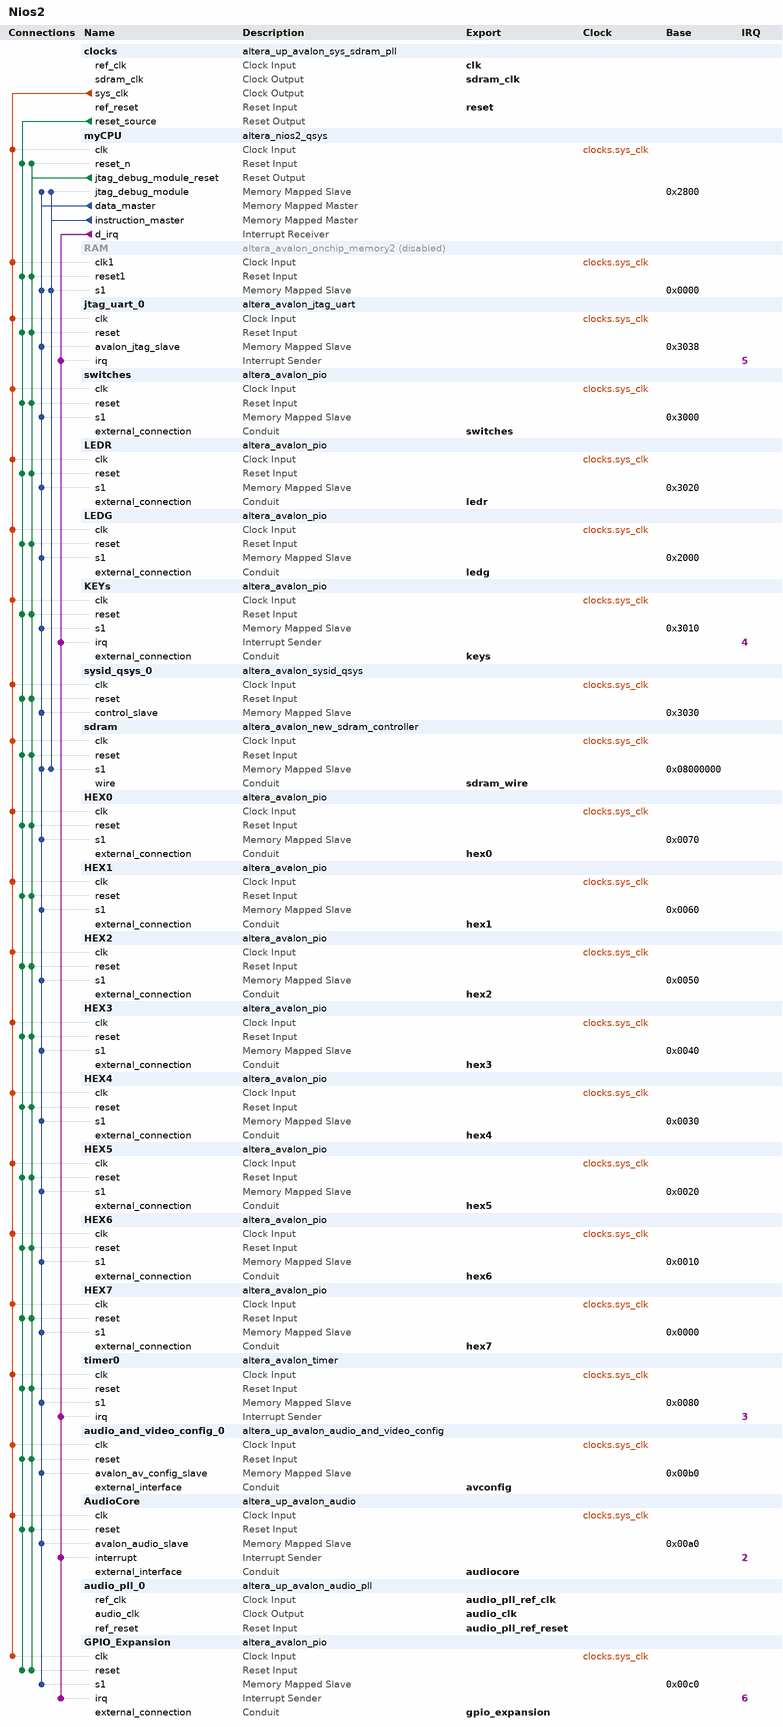
[diagram p0: system contents]
# Platform Designer (Qsys) system Nios2, Cyclone IV E EP4CE115F29C7
# Parameters at their usual value, and those the tool derives, are not listed.
package require -exact qsys 16.1
create_system Nios2
set_project_property DEVICE_FAMILY {Cyclone IV E}
set_project_property DEVICE EP4CE115F29C7

add_instance clocks altera_up_avalon_sys_sdram_pll 16.1
set_instance_parameter_value clocks CV_boards DE1-SoC
set_instance_parameter_value clocks gui_outclk 50.0
set_instance_parameter_value clocks gui_refclk 50.0

add_instance myCPU altera_nios2_qsys 16.1
set_instance_parameter_value myCPU breakSlave myCPU.jtag_debug_module
set_instance_parameter_value myCPU exceptionSlave sdram.s1
set_instance_parameter_value myCPU icache_size 4096
set_instance_parameter_value myCPU impl Fast
set_instance_parameter_value myCPU mmu_TLBMissExcSlave None
set_instance_parameter_value myCPU resetSlave sdram.s1
set_instance_parameter_value myCPU resetrequest_enabled true

add_instance RAM altera_avalon_onchip_memory2 16.1
set_instance_property RAM ENABLED false
set_instance_parameter_value RAM dataWidth 32
set_instance_parameter_value RAM dualPort false
set_instance_parameter_value RAM initMemContent true
set_instance_parameter_value RAM initializationFileName onchip_mem.hex
set_instance_parameter_value RAM memorySize 8192

add_instance jtag_uart_0 altera_avalon_jtag_uart 16.1
set_instance_parameter_value jtag_uart_0 simInteractiveOptions NO_INTERACTIVE_WINDOWS

add_instance switches altera_avalon_pio 16.1
set_instance_parameter_value switches captureEdge true
set_instance_parameter_value switches direction Input
set_instance_parameter_value switches width 18

add_instance LEDR altera_avalon_pio 16.1
set_instance_parameter_value LEDR direction Output
set_instance_parameter_value LEDR width 18

add_instance LEDG altera_avalon_pio 16.1
set_instance_parameter_value LEDG direction Output
set_instance_parameter_value LEDG width 8

add_instance KEYs altera_avalon_pio 16.1
set_instance_parameter_value KEYs captureEdge true
set_instance_parameter_value KEYs direction Input
set_instance_parameter_value KEYs edgeType FALLING
set_instance_parameter_value KEYs generateIRQ true
set_instance_parameter_value KEYs irqType EDGE
set_instance_parameter_value KEYs width 4

add_instance sysid_qsys_0 altera_avalon_sysid_qsys 16.1
set_instance_parameter_value sysid_qsys_0 id 0

add_instance sdram altera_avalon_new_sdram_controller 16.1
set_instance_parameter_value sdram TAC 5.4
set_instance_parameter_value sdram TRCD 15.0
set_instance_parameter_value sdram TRP 15.0
set_instance_parameter_value sdram casLatency 3
set_instance_parameter_value sdram columnWidth 10
set_instance_parameter_value sdram dataWidth 32
set_instance_parameter_value sdram generateSimulationModel false
set_instance_parameter_value sdram model single_Micron_MT48LC4M32B2_7_chip
set_instance_parameter_value sdram numberOfBanks 4
set_instance_parameter_value sdram numberOfChipSelects 1
set_instance_parameter_value sdram powerUpDelay 100.0
set_instance_parameter_value sdram refreshPeriod 7.8125
set_instance_parameter_value sdram rowWidth 13

add_instance HEX0 altera_avalon_pio 16.1
set_instance_parameter_value HEX0 direction Output
set_instance_parameter_value HEX0 width 7

add_instance HEX1 altera_avalon_pio 16.1
set_instance_parameter_value HEX1 direction Output
set_instance_parameter_value HEX1 width 7

add_instance HEX2 altera_avalon_pio 16.1
set_instance_parameter_value HEX2 direction Output
set_instance_parameter_value HEX2 width 7

add_instance HEX3 altera_avalon_pio 16.1
set_instance_parameter_value HEX3 direction Output
set_instance_parameter_value HEX3 width 7

add_instance HEX4 altera_avalon_pio 16.1
set_instance_parameter_value HEX4 direction Output
set_instance_parameter_value HEX4 width 7

add_instance HEX5 altera_avalon_pio 16.1
set_instance_parameter_value HEX5 direction Output
set_instance_parameter_value HEX5 width 7

add_instance HEX6 altera_avalon_pio 16.1
set_instance_parameter_value HEX6 direction Output
set_instance_parameter_value HEX6 width 7

add_instance HEX7 altera_avalon_pio 16.1
set_instance_parameter_value HEX7 direction Output
set_instance_parameter_value HEX7 width 7

add_instance timer0 altera_avalon_timer 16.1
set_instance_parameter_value timer0 period 1
set_instance_parameter_value timer0 periodUnits MSEC

add_instance audio_and_video_config_0 altera_up_avalon_audio_and_video_config 16.1
set_instance_parameter_value audio_and_video_config_0 audio_in {Line In to ADC}
set_instance_parameter_value audio_and_video_config_0 bit_length 32
set_instance_parameter_value audio_and_video_config_0 board DE2-115
set_instance_parameter_value audio_and_video_config_0 line_in_bypass false
set_instance_parameter_value audio_and_video_config_0 sampling_rate {48 kHz}

add_instance AudioCore altera_up_avalon_audio 16.1
set_instance_parameter_value AudioCore audio_in true
set_instance_parameter_value AudioCore avalon_bus_type {Memory Mapped}
set_instance_parameter_value AudioCore dw 32

add_instance audio_pll_0 altera_up_avalon_audio_pll 16.1
set_instance_parameter_value audio_pll_0 gui_refclk 50.0

add_instance GPIO_Expansion altera_avalon_pio 16.1
set_instance_parameter_value GPIO_Expansion captureEdge true
set_instance_parameter_value GPIO_Expansion direction Bidir
set_instance_parameter_value GPIO_Expansion edgeType ANY
set_instance_parameter_value GPIO_Expansion generateIRQ true
set_instance_parameter_value GPIO_Expansion irqType EDGE
set_instance_parameter_value GPIO_Expansion width 32

# connections
add_connection clocks.sys_clk audio_and_video_config_0.clk clock
add_connection clocks.sys_clk AudioCore.clk clock
add_connection clocks.sys_clk GPIO_Expansion.clk clock
add_connection clocks.sys_clk HEX0.clk clock
add_connection clocks.sys_clk HEX1.clk clock
add_connection clocks.sys_clk HEX2.clk clock
add_connection clocks.sys_clk HEX3.clk clock
add_connection clocks.sys_clk HEX4.clk clock
add_connection clocks.sys_clk HEX5.clk clock
add_connection clocks.sys_clk HEX6.clk clock
add_connection clocks.sys_clk HEX7.clk clock
add_connection clocks.sys_clk jtag_uart_0.clk clock
add_connection clocks.sys_clk KEYs.clk clock
add_connection clocks.sys_clk LEDG.clk clock
add_connection clocks.sys_clk LEDR.clk clock
add_connection clocks.sys_clk myCPU.clk clock
add_connection clocks.sys_clk RAM.clk1 clock
add_connection clocks.sys_clk sdram.clk clock
add_connection clocks.sys_clk switches.clk clock
add_connection clocks.sys_clk sysid_qsys_0.clk clock
add_connection clocks.sys_clk timer0.clk clock
add_connection clocks.reset_source audio_and_video_config_0.reset reset
add_connection clocks.reset_source AudioCore.reset reset
add_connection clocks.reset_source GPIO_Expansion.reset reset
add_connection clocks.reset_source HEX0.reset reset
add_connection clocks.reset_source HEX1.reset reset
add_connection clocks.reset_source HEX2.reset reset
add_connection clocks.reset_source HEX3.reset reset
add_connection clocks.reset_source HEX4.reset reset
add_connection clocks.reset_source HEX5.reset reset
add_connection clocks.reset_source HEX6.reset reset
add_connection clocks.reset_source HEX7.reset reset
add_connection clocks.reset_source jtag_uart_0.reset reset
add_connection clocks.reset_source KEYs.reset reset
add_connection clocks.reset_source LEDG.reset reset
add_connection clocks.reset_source LEDR.reset reset
add_connection clocks.reset_source myCPU.reset_n reset
add_connection clocks.reset_source RAM.reset1 reset
add_connection clocks.reset_source sdram.reset reset
add_connection clocks.reset_source switches.reset reset
add_connection clocks.reset_source sysid_qsys_0.reset reset
add_connection clocks.reset_source timer0.reset reset
add_connection myCPU.jtag_debug_module_reset audio_and_video_config_0.reset reset
add_connection myCPU.jtag_debug_module_reset AudioCore.reset reset
add_connection myCPU.jtag_debug_module_reset GPIO_Expansion.reset reset
add_connection myCPU.jtag_debug_module_reset HEX0.reset reset
add_connection myCPU.jtag_debug_module_reset HEX1.reset reset
add_connection myCPU.jtag_debug_module_reset HEX2.reset reset
add_connection myCPU.jtag_debug_module_reset HEX3.reset reset
add_connection myCPU.jtag_debug_module_reset HEX4.reset reset
add_connection myCPU.jtag_debug_module_reset HEX5.reset reset
add_connection myCPU.jtag_debug_module_reset HEX6.reset reset
add_connection myCPU.jtag_debug_module_reset HEX7.reset reset
add_connection myCPU.jtag_debug_module_reset jtag_uart_0.reset reset
add_connection myCPU.jtag_debug_module_reset KEYs.reset reset
add_connection myCPU.jtag_debug_module_reset LEDG.reset reset
add_connection myCPU.jtag_debug_module_reset LEDR.reset reset
add_connection myCPU.jtag_debug_module_reset myCPU.reset_n reset
add_connection myCPU.jtag_debug_module_reset RAM.reset1 reset
add_connection myCPU.jtag_debug_module_reset sdram.reset reset
add_connection myCPU.jtag_debug_module_reset switches.reset reset
add_connection myCPU.jtag_debug_module_reset sysid_qsys_0.reset reset
add_connection myCPU.jtag_debug_module_reset timer0.reset reset
add_connection myCPU.data_master audio_and_video_config_0.avalon_av_config_slave avalon
set_connection_parameter_value myCPU.data_master/audio_and_video_config_0.avalon_av_config_slave baseAddress 0x00b0
add_connection myCPU.data_master AudioCore.avalon_audio_slave avalon
set_connection_parameter_value myCPU.data_master/AudioCore.avalon_audio_slave baseAddress 0x00a0
add_connection myCPU.data_master GPIO_Expansion.s1 avalon
set_connection_parameter_value myCPU.data_master/GPIO_Expansion.s1 baseAddress 0x00c0
add_connection myCPU.data_master HEX0.s1 avalon
set_connection_parameter_value myCPU.data_master/HEX0.s1 baseAddress 0x0070
add_connection myCPU.data_master HEX1.s1 avalon
set_connection_parameter_value myCPU.data_master/HEX1.s1 baseAddress 0x0060
add_connection myCPU.data_master HEX2.s1 avalon
set_connection_parameter_value myCPU.data_master/HEX2.s1 baseAddress 0x0050
add_connection myCPU.data_master HEX3.s1 avalon
set_connection_parameter_value myCPU.data_master/HEX3.s1 baseAddress 0x0040
add_connection myCPU.data_master HEX4.s1 avalon
set_connection_parameter_value myCPU.data_master/HEX4.s1 baseAddress 0x0030
add_connection myCPU.data_master HEX5.s1 avalon
set_connection_parameter_value myCPU.data_master/HEX5.s1 baseAddress 0x0020
add_connection myCPU.data_master HEX6.s1 avalon
set_connection_parameter_value myCPU.data_master/HEX6.s1 baseAddress 0x0010
add_connection myCPU.data_master HEX7.s1 avalon
set_connection_parameter_value myCPU.data_master/HEX7.s1 baseAddress 0x0000
add_connection myCPU.data_master jtag_uart_0.avalon_jtag_slave avalon
set_connection_parameter_value myCPU.data_master/jtag_uart_0.avalon_jtag_slave baseAddress 0x3038
add_connection myCPU.data_master KEYs.s1 avalon
set_connection_parameter_value myCPU.data_master/KEYs.s1 baseAddress 0x3010
add_connection myCPU.data_master LEDG.s1 avalon
set_connection_parameter_value myCPU.data_master/LEDG.s1 baseAddress 0x2000
add_connection myCPU.data_master LEDR.s1 avalon
set_connection_parameter_value myCPU.data_master/LEDR.s1 baseAddress 0x3020
add_connection myCPU.data_master myCPU.jtag_debug_module avalon
set_connection_parameter_value myCPU.data_master/myCPU.jtag_debug_module baseAddress 0x2800
add_connection myCPU.data_master RAM.s1 avalon
set_connection_parameter_value myCPU.data_master/RAM.s1 baseAddress 0x0000
add_connection myCPU.data_master sdram.s1 avalon
set_connection_parameter_value myCPU.data_master/sdram.s1 baseAddress 0x08000000
add_connection myCPU.data_master switches.s1 avalon
set_connection_parameter_value myCPU.data_master/switches.s1 baseAddress 0x3000
add_connection myCPU.data_master sysid_qsys_0.control_slave avalon
set_connection_parameter_value myCPU.data_master/sysid_qsys_0.control_slave baseAddress 0x3030
add_connection myCPU.data_master timer0.s1 avalon
set_connection_parameter_value myCPU.data_master/timer0.s1 baseAddress 0x0080
add_connection myCPU.instruction_master myCPU.jtag_debug_module avalon
set_connection_parameter_value myCPU.instruction_master/myCPU.jtag_debug_module baseAddress 0x2800
add_connection myCPU.instruction_master RAM.s1 avalon
set_connection_parameter_value myCPU.instruction_master/RAM.s1 baseAddress 0x0000
add_connection myCPU.instruction_master sdram.s1 avalon
set_connection_parameter_value myCPU.instruction_master/sdram.s1 baseAddress 0x08000000
add_connection myCPU.d_irq AudioCore.interrupt interrupt
set_connection_parameter_value myCPU.d_irq/AudioCore.interrupt irqNumber 2
add_connection myCPU.d_irq GPIO_Expansion.irq interrupt
set_connection_parameter_value myCPU.d_irq/GPIO_Expansion.irq irqNumber 6
add_connection myCPU.d_irq jtag_uart_0.irq interrupt
set_connection_parameter_value myCPU.d_irq/jtag_uart_0.irq irqNumber 5
add_connection myCPU.d_irq KEYs.irq interrupt
set_connection_parameter_value myCPU.d_irq/KEYs.irq irqNumber 4
add_connection myCPU.d_irq timer0.irq interrupt
set_connection_parameter_value myCPU.d_irq/timer0.irq irqNumber 3

# exported interfaces
add_interface audio_clk clock source
set_interface_property audio_clk EXPORT_OF audio_pll_0.audio_clk
add_interface audio_pll_ref_clk clock sink
set_interface_property audio_pll_ref_clk EXPORT_OF audio_pll_0.ref_clk
add_interface audio_pll_ref_reset reset sink
set_interface_property audio_pll_ref_reset EXPORT_OF audio_pll_0.ref_reset
add_interface audiocore conduit end
set_interface_property audiocore EXPORT_OF AudioCore.external_interface
add_interface avconfig conduit end
set_interface_property avconfig EXPORT_OF audio_and_video_config_0.external_interface
add_interface clk clock sink
set_interface_property clk EXPORT_OF clocks.ref_clk
add_interface gpio_expansion conduit end
set_interface_property gpio_expansion EXPORT_OF GPIO_Expansion.external_connection
add_interface hex0 conduit end
set_interface_property hex0 EXPORT_OF HEX0.external_connection
add_interface hex1 conduit end
set_interface_property hex1 EXPORT_OF HEX1.external_connection
add_interface hex2 conduit end
set_interface_property hex2 EXPORT_OF HEX2.external_connection
add_interface hex3 conduit end
set_interface_property hex3 EXPORT_OF HEX3.external_connection
add_interface hex4 conduit end
set_interface_property hex4 EXPORT_OF HEX4.external_connection
add_interface hex5 conduit end
set_interface_property hex5 EXPORT_OF HEX5.external_connection
add_interface hex6 conduit end
set_interface_property hex6 EXPORT_OF HEX6.external_connection
add_interface hex7 conduit end
set_interface_property hex7 EXPORT_OF HEX7.external_connection
add_interface keys conduit end
set_interface_property keys EXPORT_OF KEYs.external_connection
add_interface ledg conduit end
set_interface_property ledg EXPORT_OF LEDG.external_connection
add_interface ledr conduit end
set_interface_property ledr EXPORT_OF LEDR.external_connection
add_interface reset reset sink
set_interface_property reset EXPORT_OF clocks.ref_reset
add_interface sdram_clk clock source
set_interface_property sdram_clk EXPORT_OF clocks.sdram_clk
add_interface sdram_wire conduit end
set_interface_property sdram_wire EXPORT_OF sdram.wire
add_interface switches conduit end
set_interface_property switches EXPORT_OF switches.external_connection

set_interconnect_requirement {$system} qsys_mm.clockCrossingAdapter HANDSHAKE
set_interconnect_requirement {$system} qsys_mm.enableEccProtection FALSE
set_interconnect_requirement {$system} qsys_mm.insertDefaultSlave FALSE
set_interconnect_requirement {$system} qsys_mm.maxAdditionalLatency 1

save_system Nios2.qsys
